# Altium schematic sheet [03] - ALIMENTACAO.SchDoc
size A4; DocumentNumber: 3; SheetNumber: 3; SheetTotal: 5; Folha: Alimentação
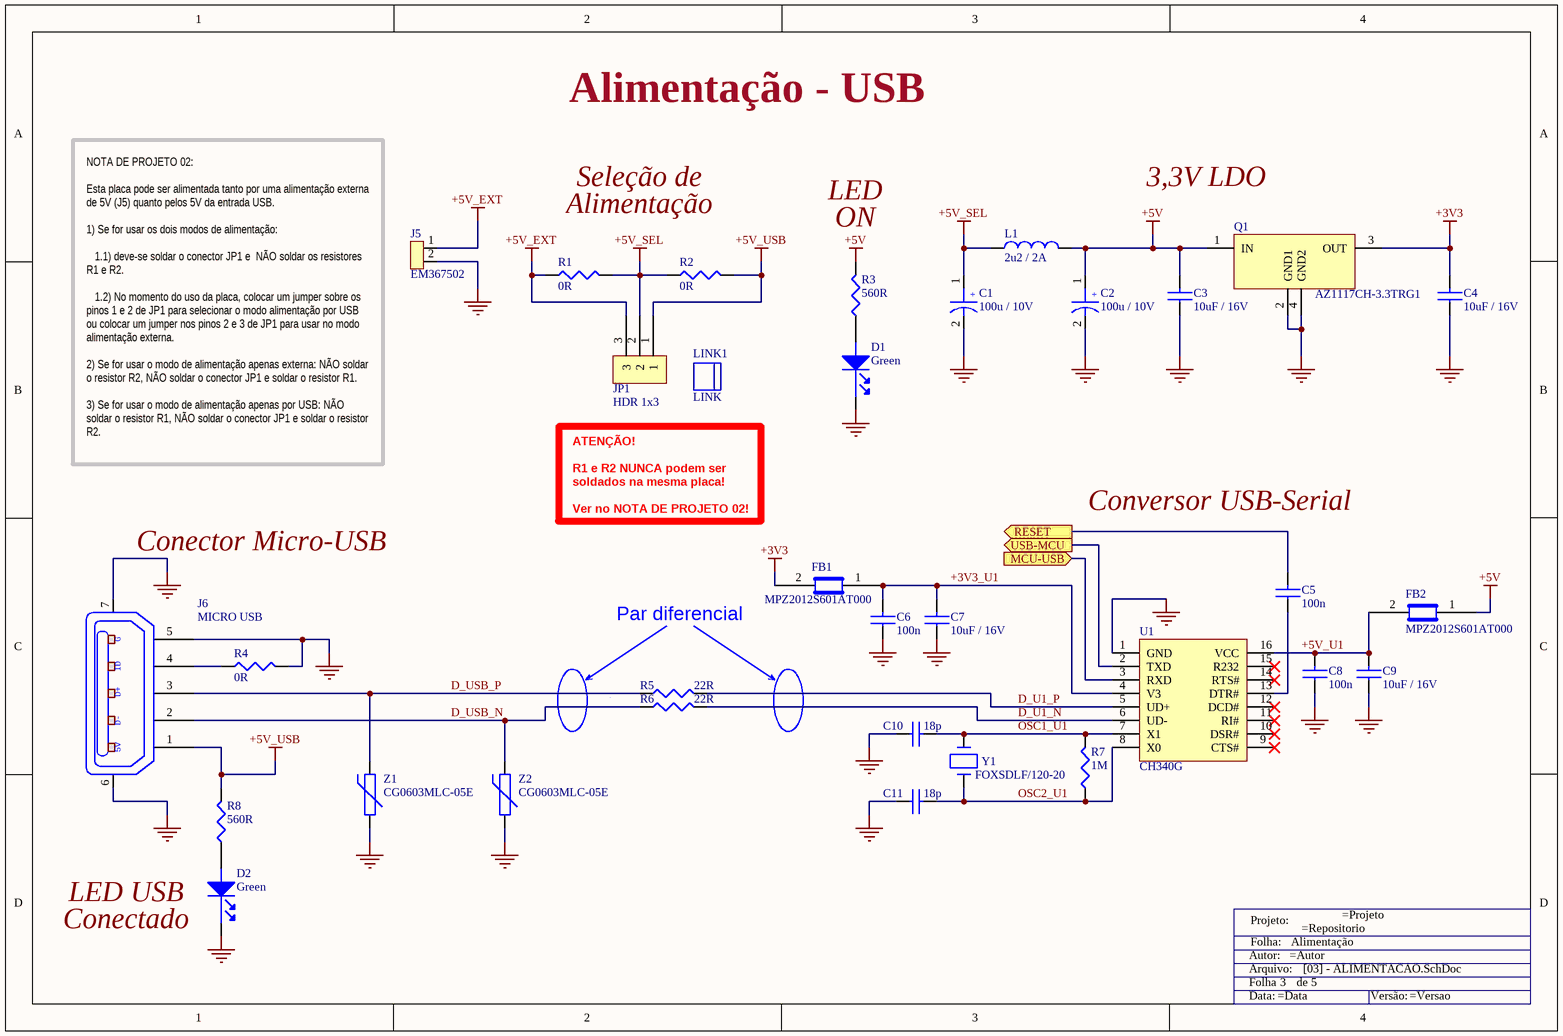
[diagram p0: [03] - ALIMENTACAO.SchDoc]

## Parts
C1  100u / 10V  [C_ALU_C_SIZE]
C2  100u / 10V  [C_ALU_C_SIZE]
C3  10uF / 16V  [C0805]
C4  10uF / 16V  [C0805]
C5  100n  [C0805]
C6  100n  [C0805]
C7  10uF / 16V  [C0805]
C8  100n  [C0805]
C9  10uF / 16V  [C0805]
C10  18p  [C0805]
C11  18p  [C0805]
D1  Green  [LED_0603]
D2  Green  [LED_0603]
FB1  MPZ2012S601AT000  [C0805]
FB2  MPZ2012S601AT000  [C0805]
J5  EM367502  [2_Pins_Fixed_Terminal]
J6  MICRO USB  [USB_ML]
JP1  HDR 1x3  [Hdr_1x3_2.54mm]
L1  2u2 / 2A  [C1210_IND]
LINK1  LINK  (mechanical)
Q1  AZ1117CH-3.3TRG1  [SOT223]
R1  0R  [R0805]
R2  0R  [R0805]
R3  560R  [R0805]
R4  0R  [R0805]
R5  22R  [R0805]
R6  22R  [R0805]
R7  1M  [R0805]
R8  560R  [R0805]
TitleBlock2  Title Block  (value not drawn)  (graphical)
U1  CH340G  [SO-16]
Y1  FOXSDLF/120-20  [HC49SD]
Z1  CG0603MLC-05E  [R0603]
Z2  CG0603MLC-05E  [R0603]

## Ports
MCU-USB (in), RESET (out), USB-MCU (out)

## Nets
+3V3: C4.2 FB1.2 Q1.3(OUT)
+5V: C2.1 C3.2 FB2.1 L1.2 Q1.1(IN) R3.2
+5V_EXT: J5.1 JP1.3 R1.1
+5V_SEL: C1.1 JP1.2 L1.1 R1.2 R2.1
+5V_USB: J6.1 JP1.1 R2.2 R8.2
GND: C1.2 C2.2 C3.1 C4.1 C6.1 C7.1 C8.1 C9.1 C10.1 C11.1 D1.1(Cathode) D2.1(Cathode) J5.2 J6.5 J6.6 J6.7 Q1.2(GND1) Q1.4(GND2) R4.2 U1.1(GND) Z1.1 Z2.1
+3V3_U1: C6.2 C7.2 FB1.1 U1.4(V3)
+5V_U1: C8.2 C9.2 FB2.2 U1.16(VCC)
D_U1_N: R6.2 U1.6(UD-)
D_U1_P: R5.2 U1.5(UD+)
D_USB_N: J6.2 R6.1 Z2.2
D_USB_P: J6.3 R5.1 Z1.2
MCU-USB: U1.3(RXD) ; port MCU-USB
OSC1_U1: C10.2 R7.2 U1.7(X1) Y1.2
OSC2_U1: C11.2 R7.1 U1.8(X0) Y1.1
RESET: C5.2 ; port RESET
USB-MCU: U1.2(TXD) ; port USB-MCU
NetC5_1: C5.1 U1.13(DTR#)
NetD1_2: D1.2(Anode) R3.1
NetD2_2: D2.2(Anode) R8.1
NetJ6_4: J6.4 R4.1

Not connected (* = marked no-connect by the designer): U1 9(CTS#)* 10(DSR#)* 11(RI#)* 12(DCD#)* 14(RTS#)* 15(R232)*

## Notes on the sheet
- Alimentação - USB
- Seleção de
- Alimentação
- LED
- (near R3) ON
- 3,3V LDO
- NOTA DE PROJETO 02:
  Esta placa pode ser alimentada tanto por uma alimentação externa de 5V (J5) quanto pelos 5V da entrada USB.
  1) Se for usar os dois modos de alimentação:
  1.1) deve-se soldar o conector JP1 e  NÃO soldar os resistores R1 e R2.
  1.2) No momento do uso da placa, colocar um jumper sobre os pinos 1 e 2 de JP1 para selecionar o modo alimentação por USB ou colocar um jumper nos pinos 2 e 3 de JP1 para usar no modo alimentação externa.
  2) Se for usar o modo de alimentação apenas externa: NÃO soldar o resistor R2, NÃO soldar o conector JP1 e soldar o resistor R1.
  3) Se for usar o modo de alimentação apenas por USB: NÃO soldar o resistor R1, NÃO soldar o conector JP1 e soldar o resistor R2.
- Conversor USB-Serial
- Conector Micro-USB
- ATENÇÃO!
  R1 e R2 NUNCA podem ser soldados na mesma placa!
  Ver no NOTA DE PROJETO 02!
- Par diferencial
- LED USB
- (near D2) Conectado
- (in symbol EEE-1AA101WR) +
- (in symbol Title Block) Projeto:; Folha:; Autor:; Arquivo:; Folha; de; Data:; Versão:
- (in symbol USB-ML) G; ID; D+; D-; 5V

## Library data of the parts
C1 C2 = EEE-1AA101WR: CAP ALUM 100UF 20% 10V SMD; Manufacturer: Panasonic Electronic Components; Capacitance: 100µF; Lifetime @ Temp.: 1000 Hrs @ 85°C; Ripple Current: 50mA; Surface Mount Land Size: 0.209" L x 0.209" W (5.30mm x 5.30mm); Supplier 1: Digi-Key; Manufacturer Part Number: EEE-1AA101WR; RoHS: RoHS Compliant; Category: Capacitors; Stock 1: 104915; Pricing 1: 1=0.44, 10=0.345, 25=0.2904, 50=0.249, 100=0.2076, 250=0.15568, 500=0.13284 (USD); Packaging: Cut Tape (CT); Tolerance: ±20%; Voltage Rating: 10V; ESR (Equivalent Series Resistance): -; Operating Temperature: -40°C ~ 85°C; Type: -; Applications: Automotive; Impedance: -; Lead Spacing: -; Size / Dimension: 0.197" Dia (5.00mm); Height - Seated (Max): 0.213" (5.40mm); Mounting Type: Surface Mount; Package / Case: Radial, Can - SMD; ComponentLink1URL: http://media.digikey.com/pdf/Data%20Sheets/Panasonic%20Electronic%20Components/S_Series_Type_V.pdf; ComponentLink1Description: http://media.digikey.com/pdf/Data%20Sheets/Panasonic%20Electronic%20Components/S_Series_Type_V.pdf; Supplier Part Number 1: PCE3867CT-ND
C3 C4 C7 C9 = C2012X5R1C106M125AC: CAP CER 10UF 16V X5R 0805; Manufacturer: TDK Corporation; Capacitance: 10µF; Tolerance: ±20%; Supplier 1: Digi-Key; Manufacturer Part Number: C2012X5R1C106M125AC; RoHS: RoHS Compliant; Category: Capacitors; Stock 1: 72024; Pricing 1: 1=0.33, 10=0.272, 100=0.136, 250=0.102, 500=0.0901, 1000=0.0799 (USD); Packaging: Cut Tape (CT); Voltage - Rated: 16V; Temperature Coefficient: X5R; Mounting Type: Surface Mount, MLCC; Operating Temperature: -55°C ~ 85°C; Applications: General Purpose; Ratings: -; Package / Case: 0805 (2012 Metric); Size / Dimension: 0.079" L x 0.049" W (2.00mm x 1.25mm); Height - Seated (Max): -; Thickness (Max): 0.057" (1.45mm); Lead Spacing: -; Features: -; Lead Style: -; ComponentLink1URL: https://product.tdk.com/info/en/catalog/datasheets/mlcc_commercial_general_en.pdf; ComponentLink1Description: https://product.tdk.com/info/en/catalog/datasheets/mlcc_commercial_general_en.pdf; Supplier Part Number 1: 445-4115-1-ND
C5 C6 C8 = C2012X7R1H104K085AA_1: CAP CER 0.1UF 50V X7R 0805; Manufacturer: TDK Corporation; Capacitance: 0.1µF; Tolerance: ±10%; Supplier 1: Digi-Key; Manufacturer Part Number: C2012X7R1H104K085AA; RoHS: RoHS Compliant; Category: Capacitors; Stock 1: 335513; Pricing 1: 1=0.1, 10=0.066, 100=0.0303, 250=0.02476, 500=0.02118, 1000=0.0165 (USD); Packaging: Cut Tape (CT); Voltage - Rated: 50V; Temperature Coefficient: X7R; Mounting Type: Surface Mount, MLCC; Operating Temperature: -55°C ~ 125°C; Applications: General Purpose; Ratings: -; Package / Case: 0805 (2012 Metric); Size / Dimension: 0.079" L x 0.049" W (2.00mm x 1.25mm); Height - Seated (Max): -; Thickness (Max): 0.037" (0.95mm); Lead Spacing: -; Features: -; Lead Style: -; ComponentLink1URL: https://product.tdk.com/info/en/catalog/datasheets/mlcc_commercial_general_en.pdf; ComponentLink1Description: https://product.tdk.com/info/en/catalog/datasheets/mlcc_commercial_general_en.pdf; Supplier Part Number 1: 445-7534-1-ND
C10 C11 = C0805C180J5GACTU: CAP CER 18PF 50V NP0 0805; Manufacturer: Kemet; Tolerance: ±5%; Temperature Coefficient: C0G, NP0; Supplier 1: Digi-Key; Manufacturer Part Number: C0805C180J5GACTU; RoHS: RoHS Compliant; Category: Capacitors; Stock 1: 159749; Pricing 1: 1=0.11, 10=0.082, 50=0.0442, 100=0.0374, 250=0.0306, 500=0.02618, 1000=0.0204 (USD); Packaging: Cut Tape (CT); Capacitance: 18pF; Voltage - Rated: 50V; Mounting Type: Surface Mount, MLCC; Operating Temperature: -55°C ~ 125°C; Applications: General Purpose; Ratings: -; Package / Case: 0805 (2012 Metric); Size / Dimension: 0.079" L x 0.049" W (2.00mm x 1.25mm); Height - Seated (Max): -; Thickness (Max): 0.035" (0.88mm); Lead Spacing: -; Features: -; Lead Style: -; ComponentLink1URL: http://www.kemet.com/docfinder?Partnumber=C0805C180J5GACTU; ComponentLink1Description: http://www.kemet.com/docfinder?Partnumber=C0805C180J5GACTU; Supplier Part Number 1: 399-1112-1-ND
D1 D2 = LG L29K-G2J1-24-Z: LED GREEN DIFFUSED 0603 SMD; Manufacturer: OSRAM Opto Semiconductors Inc.; Lens Color: White; Millicandela Rating: 3.92mcd; Lens Style/Size: Rectangle with Flat Top, 1.30mm x 0.80mm; Voltage - Forward (Vf) (Typ): 1.7V; Current - Test: 2mA; Viewing Angle: 160°; Wavelength - Dominant: 570nm; Wavelength - Peak: 572nm; Supplier 1: Digi-Key; Manufacturer Part Number: LG L29K-G2J1-24-Z; RoHS: RoHS Compliant; Category: Optoelectronics; Stock 1: 208577; Pricing 1: 1=0.36, 10=0.279, 25=0.2268, 100=0.1805, 250=0.15472, 500=0.1341, 1000=0.10316, 2500=0.09284 (USD); Packaging: Cut Tape (CT); Color: Green; Lens Transparency: Diffused; Mounting Type: Surface Mount; Features: -; Package / Case: 0603 (1608 Metric); Supplier Device Package: *; Size / Dimension: 1.70mm L x 0.80mm W; Height (Max): 0.65mm; ComponentLink1URL: http://www.osram-os.com/Graphics/XPic2/00077107_0.pdf; ComponentLink1Description: http://www.osram-os.com/Graphics/XPic2/00077107_0.pdf; Supplier Part Number 1: 475-2709-1-ND
FB1 FB2 = MPZ2012S601AT000: FERRITE CHIP BEAD 600 OHM SMD; Manufacturer: TDK Corporation; Impedance @ Frequency: 600 Ohm @ 100MHz; Current Rating: 2A; DC Resistance (DCR): 100 mOhm Max; Filter Type: Differential Mode - Single; Supplier 1: Digi-Key; Manufacturer Part Number: MPZ2012S601AT000; RoHS: RoHS Compliant; Category: Filters; Stock 1: 93838; Pricing 1: 1=0.12, 10=0.101, 100=0.0574, 250=0.04528, 500=0.03824, 1000=0.03221 (USD); Packaging: Cut Tape (CT); Package / Case: 0805 (2012 Metric); Mounting Type: Surface Mount; Height (Max): 0.041" (1.05mm); Size / Dimension: 0.079" L x 0.049" W (2.00mm x 1.25mm); ComponentLink1URL: https://product.tdk.com/info/en/catalog/datasheets/beads_commercial_power_mpz2012_en.pdf; ComponentLink1Description: https://product.tdk.com/info/en/catalog/datasheets/beads_commercial_power_mpz2012_en.pdf; Supplier Part Number 1: 445-2206-1-ND
J5 = EM367502: Fixed Terminal Blocks EURO (MA311-50002) TERM; Manufacturer: Bussmann / Eaton; Connection Method: Spring Cage; Current Rating: 10 A; Mounting Angle: Vertical; Number of Positions: 2 Position; Voltage Rating: 300 V; Pitch: 5 mm; Wire Gauge Range: 26 AWG to 14 AWG; Supplier 1: Mouser; Manufacturer Part Number: EM367502; RoHS: RoHS Compliant; Category: Fixed Terminal Blocks; Stock 1: 1498; Pricing 1: 1=0.260, 10=0.250, 100=0.240, 250=0.226, 500=0.214, 1000=0.203, 2000=0.190, 5000=0.179, 10000=0.164 (USD); Color: Green; Contact Plating: Tin; Housing Material: Thermoplastic; Packaging: Bulk; Product: Fixed Terminal Blocks; Series: EM3675; Termination Style: Through Hole; Brand: Bussmann / Eaton; Contact Material: Brass; Flammability Rating: UL 94 V-0; Standard Pack Qty: 100; Tradename: EuroMag; RoHS - Mouser: Y; Minimum Order Quantity: 1; Reeling: False; ComponentLink1URL: http://www.mouser.com/ds/2/87/Bus_Elx_DS_EM3675_Spring_Clamp-1066360.pdf; ComponentLink1Description: http://www.mouser.com/ds/2/87/Bus_Elx_DS_EM3675_Spring_Clamp-1066360.pdf; Supplier Part Number 1: 504-EM367502
J6 = USB-ML: CONN USB MICRO B RECPT SMT R/A; Manufacturer: ??; Manufacturer Part Number: ML-01; Connector Type: USB - micro B; Number of Contacts: 5; Gender: Receptacle; Specifications: USB 2.0; RoHS: RoHS Compliant; Category: Connectors, Interconnects; Pricing 1: 1=0.46, 10=0.433, 25=0.3712, 50=0.3156, 100=0.3032, 250=0.27224, 500=0.25988 (USD); Packaging: Cut Tape (CT); Mounting Type: Surface Mount, Right Angle, Horizontal; Features: Shielded, Solder Retention; Ingress Protection: -
JP1 = 68000-103HLF: BERGSTIK II .100" SR STRAIGHT; Manufacturer: FCI; Connector Type: Header, Unshrouded; Number of Positions: 3; Number of Positions Loaded: All; Pitch: 0.100" (2.54mm); Supplier 1: Digi-Key; Manufacturer Part Number: 68000-103HLF; RoHS: RoHS Compliant; Category: Connectors, Interconnects; Stock 1: 54154; Pricing 1: 1=0.26, 10=0.249, 25=0.2136, 50=0.1816, 100=0.1744, 250=0.15664, 500=0.14952, 1000=0.1246, 2500=0.11392 (USD); Packaging: Bulk; Contact Type: Male Pin; Number of Rows: 1; Row Spacing: -; Contact Mating Length: 0.230" (5.84mm); Mounting Type: Through Hole; Termination: Solder; Fastening Type: -; Features: -; Contact Finish: Gold or Gold, GXT™; Contact Finish Thickness: 30µin (0.76µm); Color: Black; ComponentLink1URL: http://portal.fciconnect.com/Comergent//fci/drawing/68000.pdf; ComponentLink1Description: http://portal.fciconnect.com/Comergent//fci/drawing/68000.pdf; Supplier Part Number 1: 609-3461-ND
L1 = L1210R2R2MDWIT: FIXED IND 2.2UH 2A 80 MOHM SMD; Manufacturer: Kemet; Type: Wirewound; Material - Core: Ferrite; Inductance: 2.2µH; Tolerance: ±20%; Shielding: Unshielded; DC Resistance (DCR): 80 mOhm; Frequency - Self Resonant: 190MHz; Frequency - Test: 100kHz; Supplier 1: Digi-Key; Manufacturer Part Number: L1210R2R2MDWIT; RoHS: RoHS Compliant; Category: Inductors, Coils, Chokes; Stock 1: 1408; Pricing 1: 1=0.54, 10=0.476, 25=0.4464, 50=0.3868, 100=0.357, 250=0.33916, 500=0.3094 (USD); Packaging: Cut Tape (CT); Current Rating: 2A; Current - Saturation: -; Q @ Freq: -; Operating Temperature: -40°C ~ 105°C; Mounting Type: Surface Mount; Package / Case: 1210 (3225 Metric); Size / Dimension: 0.126" L x 0.098" W (3.20mm x 2.50mm); Height - Seated (Max): 0.106" (2.70mm); Supplier Device Package: 1210; ComponentLink1URL: http://www.kemet.com/Lists/ProductCatalog/Attachments/57/F3115.pdf; ComponentLink1Description: http://www.kemet.com/Lists/ProductCatalog/Attachments/57/F3115.pdf; Supplier Part Number 1: 399-9598-1-ND
LINK1 = QPC02SXGN-RC: CONN JUMPER SHORTING .100" GOLD; Manufacturer: Sullins Connector Solutions; Gender: Female Sockets; Number of Positions or Pins (Grid): 2 (1 x 2); Pitch: 0.100" (2.54mm); Supplier 1: Digi-Key; Manufacturer Part Number: QPC02SXGN-RC; RoHS: RoHS Compliant; Category: Connectors, Interconnects; Stock 1: 91424; Pricing 1: 1=0.13, 10=0.077, 25=0.0548, 50=0.0448, 100=0.0385, 250=0.03256, 500=0.0301, 1000=0.0266, 2500=0.021 (USD); Packaging: Bulk; Type: Open Top; Height: 0.235" (5.97mm); Contact Finish: Gold; Contact Finish Thickness: Flash; Color: Black; ComponentLink1URL: http://www.sullinscorp.com/drawings/284_SXGN_11510.pdf; ComponentLink1Description: http://www.sullinscorp.com/drawings/284_SXGN_11510.pdf; Supplier Part Number 1: S9337-ND
Q1 = AZ1117CH-3.3TRG1: LDO Voltage Regulators LDO BJT HiCurr 1.15V at 1A; Manufacturer: Diodes Incorporated; Input Voltage MAX: 15 V; Number of Outputs: 1 Output; Output Current: 800 mA; Output Type: Fixed; Output Voltage: 3.3 V; Quiescent Current: 4 mA; Type: Linear Regulator; Dropout Voltage - Max: 1.3 V; PSRR / Ripple Rejection - Typ: 70 dB; Dropout Voltage: 1.2 V; Line Regulation: 500 uV; Load Regulation: 2 mV; Supplier 1: Mouser; Manufacturer Part Number: AZ1117CH-3.3TRG1; RoHS: RoHS Compliant; Category: LDO Voltage Regulators; Stock 1: 11685; Pricing 1: 1=0.380, 10=0.262, 100=0.120, 1000=0.093, 4000=0.079, 8000=0.072, 24000=0.067, 48000=0.060, 100000=0.058 (USD); Package / Case: SOT-223-3; Packaging: Cut Tape; Product: LDO Voltage Regulators; Series: AZ1117; Brand: Diodes Incorporated; Mounting Style: SMD/SMT; Output Voltage Range: -; Maximum Operating Temperature: + 125 C; Minimum Operating Temperature: - 20 C; Moisture Sensitive: Yes; Standard Pack Qty: 4000; RoHS - Mouser: Y; Minimum Order Quantity: 1; Reeling: True; ComponentLink1URL: http://www.mouser.com/ds/2/115/AZ1117C-271627.pdf; ComponentLink1Description: http://www.mouser.com/ds/2/115/AZ1117C-271627.pdf; Supplier Part Number 1: 621-AZ1117CH-3.3TRG1
R1 R2 R4 = RC0805JR-070RL: RES SMD 0.0 OHM JUMPER 1/8W 0805; Manufacturer: Yageo; Resistance (Ohms): 0.0; Power (Watts): 0.125W, 1/8W; Supplier 1: Digi-Key; Manufacturer Part Number: RC0805JR-070RL; RoHS: RoHS Compliant; Category: Resistors; Stock 1: 2285545; Pricing 1: 1=0.1, 10=0.018, 25=0.0128, 100=0.0073, 250=0.00556, 500=0.00444, 1000=0.00326, 2500=0.00283 (USD); Packaging: Cut Tape (CT); Tolerance: Jumper; Composition: Thick Film; Features: Moisture Resistant; Temperature Coefficient: -; Operating Temperature: -55°C ~ 155°C; Package / Case: 0805 (2012 Metric); Supplier Device Package: 0805; Size / Dimension: 0.079" L x 0.049" W (2.00mm x 1.25mm); Height: 0.024" (0.60mm); Number of Terminations: 2; ComponentLink1URL: http://www.yageo.com/NewPortal/yageodocoutput?fileName=/pdf/R-Chip/PYu-RC_Group_51_RoHS_L_3.pdf; ComponentLink1Description: http://www.yageo.com/NewPortal/yageodocoutput?fileName=/pdf/R-Chip/PYu-RC_Group_51_RoHS_L_3.pdf; Supplier Part Number 1: 311-0.0ARCT-ND
R3 R8 = RC0805FR-07560RL: RES SMD 560 OHM 1% 1/8W 0805; Manufacturer: Yageo; Resistance (Ohms): 560; Power (Watts): 0.125W, 1/8W; Temperature Coefficient: ±100ppm/°C; Supplier 1: Digi-Key; Manufacturer Part Number: RC0805FR-07560RL; RoHS: RoHS Compliant; Category: Resistors; Stock 1: 245556; Pricing 1: 1=0.1, 10=0.021, 25=0.0152, 100=0.0084, 250=0.00644, 500=0.00514, 1000=0.00379, 2500=0.00329 (USD); Packaging: Cut Tape (CT); Tolerance: ±1%; Composition: Thick Film; Features: Moisture Resistant; Operating Temperature: -55°C ~ 155°C; Package / Case: 0805 (2012 Metric); Supplier Device Package: 0805; Size / Dimension: 0.079" L x 0.049" W (2.00mm x 1.25mm); Height: 0.024" (0.60mm); Number of Terminations: 2; ComponentLink1URL: http://www.yageo.com/NewPortal/yageodocoutput?fileName=/pdf/R-Chip/PYu-RC_Group_51_RoHS_L_3.pdf; ComponentLink1Description: http://www.yageo.com/NewPortal/yageodocoutput?fileName=/pdf/R-Chip/PYu-RC_Group_51_RoHS_L_3.pdf; Supplier Part Number 1: 311-560CRCT-ND
R5 R6 = RC0805FR-0722RL: RES SMD 22 OHM 1% 1/8W 0805; Manufacturer: Yageo; Resistance (Ohms): 22; Power (Watts): 0.125W, 1/8W; Temperature Coefficient: ±100ppm/°C; Supplier 1: Digi-Key; Manufacturer Part Number: RC0805FR-0722RL; RoHS: RoHS Compliant; Category: Resistors; Stock 1: 106658; Pricing 1: 1=0.1, 10=0.021, 25=0.0152, 100=0.0084, 250=0.00644, 500=0.00514, 1000=0.00379, 2500=0.00329 (USD); Packaging: Cut Tape (CT); Tolerance: ±1%; Composition: Thick Film; Features: Moisture Resistant; Operating Temperature: -55°C ~ 155°C; Package / Case: 0805 (2012 Metric); Supplier Device Package: 0805; Size / Dimension: 0.079" L x 0.049" W (2.00mm x 1.25mm); Height: 0.024" (0.60mm); Number of Terminations: 2; ComponentLink1URL: http://www.yageo.com/NewPortal/yageodocoutput?fileName=/pdf/R-Chip/PYu-RC_Group_51_RoHS_L_3.pdf; ComponentLink1Description: http://www.yageo.com/NewPortal/yageodocoutput?fileName=/pdf/R-Chip/PYu-RC_Group_51_RoHS_L_3.pdf; Supplier Part Number 1: 311-22.0CRCT-ND
R7 = RC0805FR-071ML: RES SMD 1M OHM 1% 1/8W 0805; Manufacturer: Yageo; Power (Watts): 0.125W, 1/8W; Temperature Coefficient: ±100ppm/°C; Supplier 1: Digi-Key; Manufacturer Part Number: RC0805FR-071ML; RoHS: RoHS Compliant; Category: Resistors; Stock 1: 426248; Pricing 1: 1=0.1, 10=0.021, 25=0.0152, 100=0.0084, 250=0.00644, 500=0.00514, 1000=0.00379, 2500=0.00329 (USD); Packaging: Cut Tape (CT); Resistance (Ohms): 1M; Tolerance: ±1%; Composition: Thick Film; Features: Moisture Resistant; Operating Temperature: -55°C ~ 155°C; Package / Case: 0805 (2012 Metric); Supplier Device Package: 0805; Size / Dimension: 0.079" L x 0.049" W (2.00mm x 1.25mm); Height: 0.024" (0.60mm); Number of Terminations: 2; ComponentLink1URL: http://www.yageo.com/NewPortal/yageodocoutput?fileName=/pdf/R-Chip/PYu-RC_Group_51_RoHS_L_3.pdf; ComponentLink1Description: http://www.yageo.com/NewPortal/yageodocoutput?fileName=/pdf/R-Chip/PYu-RC_Group_51_RoHS_L_3.pdf; Supplier Part Number 1: 311-1.00MCRCT-ND
U1 = CH340G: USB bus adapters; Manufacturer: Chinese; Maximum Clock Frequency: 12 MHz; Operating Supply Voltage: 3.3 V to 5.5 V; Supply Voltage - Max: 5.5 V; Supply Voltage - Min: 3.3 V; Manufacturer Part Number: CH340G; Category: USB bus adapters; Pricing 1: 1=2.07, 25=1.89, 100=1.72, 1000=1.64 (USD); Package / Case: SO-16; Product: MCU; Series: CH340; Mounting Style: SMD/SMT; Maximum Operating Temperature: + 85 C; Minimum Operating Temperature: - 40 C; Minimum Order Quantity: 1
Y1 = FOXSDLF/120-20: Crystals 12MHz 20pF; Manufacturer: Fox; Frequency Stability: 50 PPM; Supplier 1: Mouser; Manufacturer Part Number: FOXSDLF/120-20; RoHS: RoHS Compliant; Category: Crystals; Stock 1: 4211; Pricing 1: 1=0.270, 10=0.225, 50=0.203, 100=0.180, 500=0.171, 1000=0.144, 2000=0.135, 5000=0.130, 10000=0.126 (USD); Frequency: 12 MHz; Height: 4.5 mm; Length: 13.9 mm; Load Capacitance: 20 pF; Package / Case: HC-49/US; Packaging: Cut Tape; Series: FOXSDLF; Termination Style: SMD/SMT; Tolerance: 50 PPM; Width: 5 mm; Brand: Fox; Mounting Style: SMD/SMT; Maximum Operating Temperature: + 70 C; Minimum Operating Temperature: - 10 C; Standard Pack Qty: 1000; RoHS - Mouser: Y; Minimum Order Quantity: 1; Reeling: True; ComponentLink1URL: http://www.mouser.com/ds/2/160/C4SD-1131563.pdf; ComponentLink1Description: http://www.mouser.com/ds/2/160/C4SD-1131563.pdf; Supplier Part Number 1: 559-FOXSD120-20-LF
Z1 Z2 = CG0603MLC-05E: VARISTOR 0603; Manufacturer: Bourns Inc.; Number of Circuits: 1; Maximum DC Volts: 5VDC; Supplier 1: Digi-Key; Manufacturer Part Number: CG0603MLC-05E; RoHS: RoHS Compliant; Category: Circuit Protection; Stock 1: 102370; Pricing 1: 1=0.19, 10=0.177, 25=0.164, 50=0.158, 100=0.1472, 250=0.13104, 500=0.1092, 1000=0.10348, 2500=0.09256 (USD); Packaging: Cut Tape (CT); Varistor Voltage (Min): -; Varistor Voltage (Typ): -; Varistor Voltage (Max): -; Current - Surge: -; Maximum AC Volts: -; Energy: -; Package / Case: 0603 (1608 Metric); Mounting Type: Surface Mount, MLCV; ComponentLink1URL: http://www.bourns.com/docs/Product-Datasheets/MLC.pdf; ComponentLink1Description: http://www.bourns.com/docs/Product-Datasheets/MLC.pdf; Supplier Part Number 1: CG0603MLC-05ECT-ND